# Altium schematic sheet conn_board_interfaces.SchDoc
size A
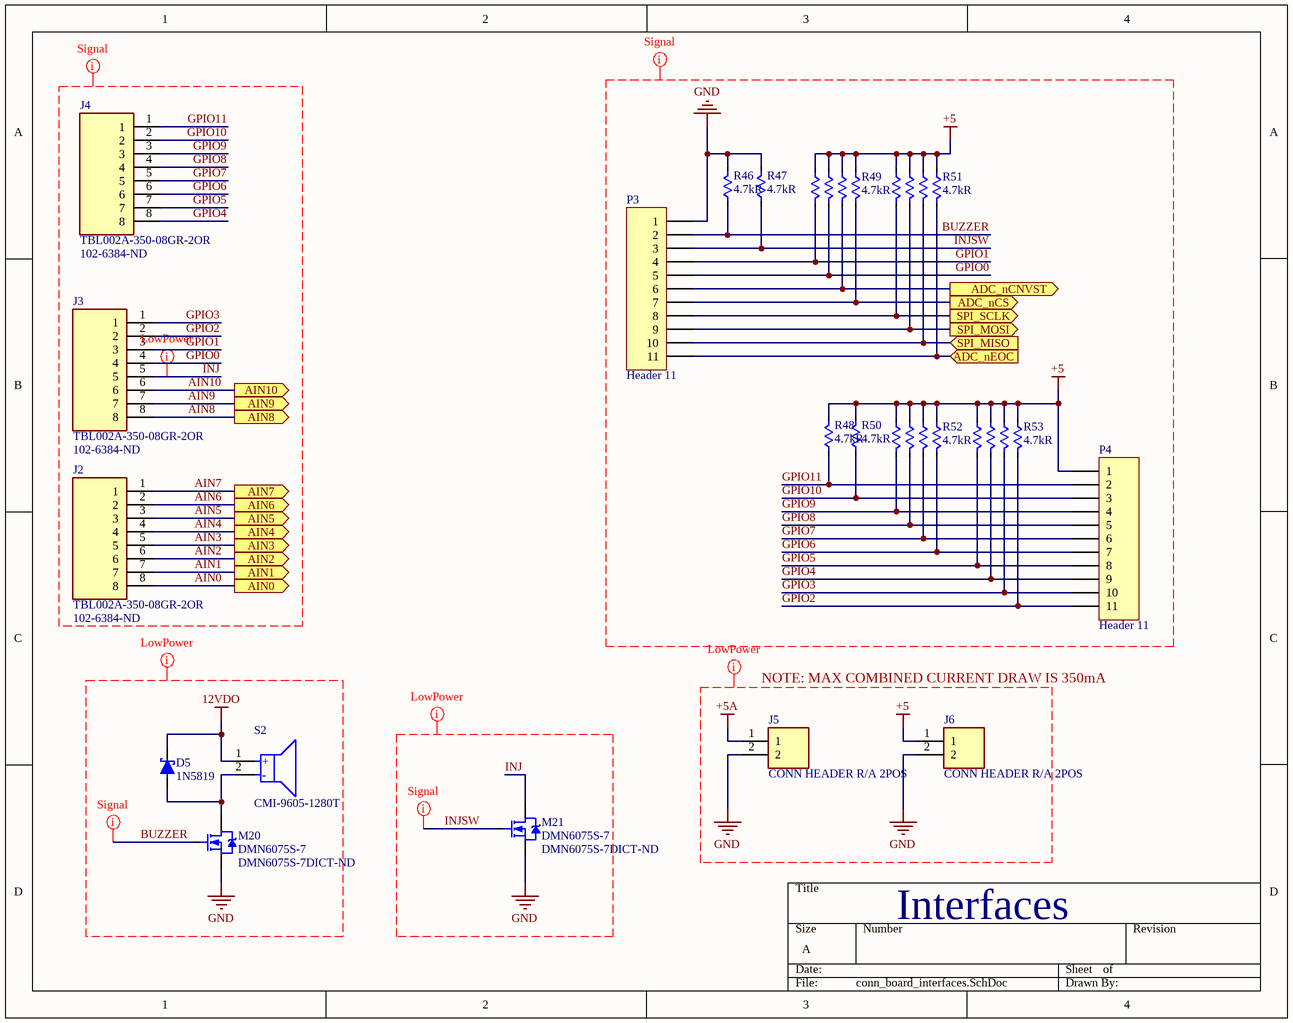
[diagram p0: conn_board_interfaces.SchDoc]

## Parts
D5  1N5819  [SOD123]
J2  TBL002A-350-08GR-2OR  Supplier Part Number 1: 102-6384-ND  [CUI_TBL002A-350-08GR-2OR]
J3  TBL002A-350-08GR-2OR  Supplier Part Number 1: 102-6384-ND  [CUI_TBL002A-350-08GR-2OR]
J4  TBL002A-350-08GR-2OR  Supplier Part Number 1: 102-6384-ND  [CUI_TBL002A-350-08GR-2OR]
J5  CONN HEADER R/A 2POS  [2 POS MOLEX]
J6  CONN HEADER R/A 2POS  [2 POS MOLEX]
M20  DMN6075S-7  Supplier Part Number 1: DMN6075S-7DICT-ND  [FP-SOT23-MFG]
M21  DMN6075S-7  Supplier Part Number 1: DMN6075S-7DICT-ND  [FP-SOT23-MFG]
P3  Header 11  [HDR1X11]
P4  Header 11  [HDR1X11]
R46  4.7kR  [RES_0805_PANASONIC]
R47  4.7kR  [RES_0805_PANASONIC]
R48  4.7kR  [RES_0805_PANASONIC]
R49  4.7kR  [CAY16-472J4LF]
R50  4.7kR  [RES_0805_PANASONIC]
R51  4.7kR  [CAY16-472J4LF]
R52  4.7kR  [CAY16-472J4LF]
R53  4.7kR  [CAY16-472J4LF]
S2  CMI-9605-1280T  [CMI-9605-1280T]

## Ports
ADC_nCNVST (out), ADC_nCS (out), ADC_nEOC (in), AIN0 (out), AIN1 (out), AIN2 (out), AIN3 (out), AIN4 (out), AIN5 (out), AIN6 (out), AIN7 (out), AIN8 (out), AIN9 (out), AIN10 (out), SPI_MISO (in), SPI_MOSI (out), SPI_SCLK (out)

## Nets
12VDO: D5.1 S2.1(+)
+5: J6.1 P4.1 R48.2 R49.2 R49.4 R49.6 R49.8 R50.2 R51.2 R51.4 R51.6 R51.8 R52.2 R52.4 R52.6 R52.8 R53.2 R53.4 R53.6 R53.8
+5A: J5.1
GND: J5.2 J6.2 M20.S M21.S P3.1 R46.2 R47.2
ADC_nCNVST: P3.6 R49.5 ; port ADC_nCNVST
ADC_nCS: P3.7 R49.7 ; port ADC_nCS
ADC_nEOC: P3.11 R51.7 ; port ADC_nEOC
AIN0: J2.8 ; port AIN0
AIN1: J2.7 ; port AIN1
AIN2: J2.6 ; port AIN2
AIN3: J2.5 ; port AIN3
AIN4: J2.4 ; port AIN4
AIN5: J2.3 ; port AIN5
AIN6: J2.2 ; port AIN6
AIN7: J2.1 ; port AIN7
AIN8: J3.8 ; port AIN8
AIN9: J3.7 ; port AIN9
AIN10: J3.6 ; port AIN10
BUZZER: M20.G P3.2 R46.1
GPIO0: J3.4 P3.5 R49.3
GPIO1: J3.3 P3.4 R49.1
GPIO2: J3.2 P4.11 R53.7
GPIO3: J3.1 P4.10 R53.5
GPIO4: J4.8 P4.9 R53.3
GPIO5: J4.7 P4.8 R53.1
GPIO6: J4.6 P4.7 R52.7
GPIO7: J4.5 P4.6 R52.5
GPIO8: J4.4 P4.5 R52.3
GPIO9: J4.3 P4.4 R52.1
GPIO10: J4.2 P4.3 R50.1
GPIO11: J4.1 P4.2 R48.1
INJ: J3.5 M21.D
INJSW: M21.G P3.3 R47.1
SPI_MISO: P3.10 R51.5 ; port SPI_MISO
SPI_MOSI: P3.9 R51.3 ; port SPI_MOSI
SPI_SCLK: P3.8 R51.1 ; port SPI_SCLK
NetD5_2: D5.2 M20.D S2.2(-)

## Layout directives
net class Signal: +5, AIN0, AIN1, AIN2, AIN3, AIN4, AIN5, AIN6, AIN7, AIN8, AIN9, AIN10, BUZZER, GND, GPIO0, GPIO1, GPIO2, GPIO3, GPIO4, GPIO5, GPIO6, GPIO7, GPIO8, GPIO9, GPIO10, GPIO11, INJ, INJSW
net class LowPower: 12VDO, +5, +5A, BUZZER, GND, INJ, INJSW
mark named Signal: BUZZER, INJSW

## Notes on the sheet
- NOTE: MAX COMBINED CURRENT DRAW IS 350mA
- Interfaces

## Library data of the parts
D5 = 1N5819HW-7-F: DIODES INC. - 1N5819HW-7-F - DIODE, SCKY RECTI, 1A, 40V, SOD123; Element Configuration: Single; Peak Non-Repetitive Surge Current: 25A; Forward Voltage: 450mV; Peak Reverse Current: 50uA; Polarity: Standard; Capacitance: 110pF; Max Power Dissipation: 450mW; Supplier 1: Digi-Key; Manufacturer: Diodes; Manufacturer Part Number: 1N5819HW-7-F; RoHS: Yes; Category: Diode; Stock 1: 502732; Pricing 1: 1=0.40000, 10=0.30100, 25=0.26360, 100=0.14310, 500=0.11678, 1000=0.08664 (USD); Case/Package: SOD-123-2; Number of Pins: 2; Weight: 0.000353oz; Contact Plating: Tin,Matte; Min Operating Temperature: -65°C; Max Operating Temperature: 125°C; Packaging: Tape and Reel; Package Quantity: 3000; Forward Current: 1A; Max Repetitive Reverse Voltage (Vrrm): 40V; Average Rectified Current: 1A; Max Reverse Voltage (DC): 40V; Max Forward Surge Current (Ifsm): 25A; Current Rating: 1A; Voltage Rating (DC): 40V; Output Current: 1A; Termination: SMD/SMT; Length: 2.85mm; Height: 1.25mm; Width: 1.7mm; Radiation Hardening: No; Lead Free: Lead Free; REACH SVHC: No SVHC; ComponentLink1URL: https://datasheet.ciiva.com/16303/ds30217-16303296.pdf?src-supplier=Future+Electronics; ComponentLink1Description: https://datasheet.ciiva.com/16303/ds30217-16303296.pdf?src-supplier=Future+Electronics; ComponentLink2URL: https://datasheet.ciiva.com/27092/1538419-27092484.pdf?src-supplier=Jameco; ComponentLink2Description: https://datasheet.ciiva.com/27092/1538419-27092484.pdf?src-supplier=Jameco; ComponentLink3URL: https://datasheet.ciiva.com/912/ds30217-912801.pdf?src-supplier=Digi-Key; ComponentLink3Description: https://datasheet.ciiva.com/912/ds30217-912801.pdf?src-supplier=Digi-Key; ComponentLink4URL: https://datasheet.ciiva.com/1177/ds30217-1177089.pdf?src-supplier=Element14; ComponentLink4Description: https://datasheet.ciiva.com/1177/ds30217-1177089.pdf?src-supplier=Element14; ComponentLink5URL: https://datasheet.ciiva.com/912/ds30217-912802.pdf?src-supplier=Digi-Key; ComponentLink5Description: https://datasheet.ciiva.com/912/ds30217-912802.pdf?src-supplier=Digi-Key; ComponentLink6URL: https://datasheet.ciiva.com/912/ds30217-912803.pdf?src-supplier=Digi-Key; ComponentLink6Description: https://datasheet.ciiva.com/912/ds30217-912803.pdf?src-supplier=Digi-Key; ComponentLink7URL: https://datasheet.ciiva.com/8303/ds30217-8303132.pdf?src-supplier=Avnet; ComponentLink7Description: https://datasheet.ciiva.com/8303/ds30217-8303132.pdf?src-supplier=Avnet; ComponentLink8URL: https://datasheet.ciiva.com/25919/ds30217-25919644.pdf?src-supplier=Avnet+Europe; ComponentLink8Description: https://datasheet.ciiva.com/25919/ds30217-25919644.pdf?src-supplier=Avnet+Europe; Supplier Part Number 1: 1N5819HW-FDICT-ND
J2-J4 = TBL002A-350-08GR-2OR: 1~24 Poles, Screwless, 45Â°, 3.50 Pitch, 24~20 (AWG), Terminal Block Connector; MF: CUI Devices; SnapEDA_Link: https://www.snapeda.com/parts/TBL002A-350-08GR-2OR/CUI%20Devices/view-part/3233590/?ref=snap; Availability: Unavailable; Price: None; MP: TBL002A-350-08GR-2OR; Package: None; Value: *; Category: Connector; Supplier 1: Digi-Key
J5 J6 = 1724480002: Manufacturer: Molex; Connector Type: Male Pin; Number of Circuits: 2; Row Spacing: 0.165inch; Glow Wire Compliant: Compliant; Supplier 1: Digi-Key; Manufacturer Part Number: 1724480002; RoHS: No; Category: Headers and Wire Housings; Stock 1: 6210; Pricing 1: 1=0.55000, 10=0.46000, 100=0.35780, 1000=0.28116, 5000=0.24708, 10000=0.23004 (USD); Mount: Through Hole; Number of Pins: 2; Contact Plating: Tin; Color: Black; Orientation: Right Angle; Packaging: Tray; Number of Positions: 2; Number of Rows: 2; Termination: Solder; Fastening Type: Ramp; ComponentLink1URL: https://www.molex.com/pdm_docs/sd/1724480002_sd.pdf?src-supplier=Digi-Key; ComponentLink1Description: https://www.molex.com/pdm_docs/sd/1724480002_sd.pdf?src-supplier=Digi-Key; Supplier Part Number 1: WM16206-ND
M20 M21 = CMP-12801-000014-1: MOSFET 60V N-Ch Enh FET 20Vgss 0.8W 600pF; Manufacturer: Diodes Inc.; Max Junction Temp: +150°C; Continuous Drain Current: 2A; Rthja Max: 157°C/W; Turn On Delay Time: 3.5ns; Gate To Source Voltage: 20V; Input Capacitace At Vds: 606pF @ 20V; Depletion Mode: False; Number Of Channels: 1; Pulse Drain Current: 12A; Standoff Height: 0.013mm; Turn Off Delay Time: 35ns; Threshold Vgs Max: 3V; Automotive Grade: Grade 0; Max Forward Diode Voltage: 1.2V; Gate Charge At Vgs: 12.3nC @ 10V; Threshold Vgs Min: 1V; Drain To Source Resistance: 69mΩ; Rds On Max: 85mR; Input Capacitance: 606pF; Max Power Dissipation: 800mW; Device Class L2: Transistors; Height: 1.1mm; ComponentLink2Description: Datasheet; Footprint Url: https://www.diodes.com/assets/Package-Files/SOT23.pdf; Device Class L1: Discrete Semiconductors; Digikey Description: MOSFET N-CH 60V 2A SOT23-3; Device Class L3: MOSFETs; Mouser Description: MOSFET 60V N-Ch Enh FET 20Vgss 0.8W 600pF; Manufacturer Part Number: DMN6075S-7; Package: SOT23; Power Dissipation: 0.8W; Temperature Range High: +150°C; Drain To Source Breakdown Voltage: 60V; Automotive: Yes; Lead Free: Yes; ComponentLink2URL: https://www.diodes.com/assets/Datasheets/DMN6075S.pdf; Category: Trans; Temperature Range Low: -55°C; Number Of N Channels: 1; Octopart: https://octopart.com/dmn6075s-7-diodes+inc.-55697882; RoHS: TRUE; Temperature: -55°C to +150°C; Drain To Source Voltage: 60V; Supplier 1: Digi-Key; Stock 1: 363651; Pricing 1: 1=0.33000, 10=0.23000, 25=0.21440, 100=0.11630, 500=0.09486, 1000=0.07038 (USD); Mount: Surface Mount; Case/Package: TO-236-3; Min Operating Temperature: -55°C; Max Operating Temperature: 150°C; Packaging: Tape and Reel; Drain to Source Voltage (Vdss): 60V; Continuous Drain Current (ID): 2A; ComponentLink1URL: http://www.mouser.com/ds/2/115/DMN6075S-532804.pdf?src-supplier=Mouser; ComponentLink1Description: http://www.mouser.com/ds/2/115/DMN6075S-532804.pdf?src-supplier=Mouser; ComponentLink3URL: https://www.diodes.com/assets/Datasheets/DMN6075S.pdf?src-supplier=Digi-Key; ComponentLink3Description: https://www.diodes.com/assets/Datasheets/DMN6075S.pdf?src-supplier=Digi-Key
P3 P4 = Header 11: Header, 11-Pin; LatestRevisionDate: 17-Jul-2002; LatestRevisionNote: Re-released for DXP Platform.; Publisher: Altium Limited
R46-R48 R50 = ERA-6AED472V: Res Thin Film 0805 4.7K Ohm 0.5% 0.125W(1/8W) ±25ppm/C Molded SMD Automotive Punched T/R; Manufacturer: Panasonic; Temperature Coefficient: 25ppm/°C; Power Rating: 125mW; Voltage Rating: 100V; Supplier 1: Digi-Key; Manufacturer Part Number: ERA-6AED472V; RoHS: Yes; Category: Chip SMD Resistors; Stock 1: 25343; Pricing 1: 1=0.10000, 10=0.09400, 100=0.03600, 1000=0.01584, 2500=0.01368 (USD); Case/Package: 0805; Case Code (Metric): 2012; Case Code (Imperial): 0805; Min Operating Temperature: -55°C; Max Operating Temperature: 155°C; Package Quantity: 5000; Packaging: Tape and Reel; Resistance: 4.7kR; Tolerance: 0.5%; Length: 2mm; Height: 0.5mm; Width: 1.25mm; Lead Free: Lead Free; ComponentLink1URL: https://datasheet.ciiva.com/24027/aoa0000ce26-32660-24027576.pdf?src-supplier=Mouser; ComponentLink1Description: https://datasheet.ciiva.com/24027/aoa0000ce26-32660-24027576.pdf?src-supplier=Mouser; Supplier Part Number 1: P123914CT-ND; Mount: Surface Mount; Contact Plating: Tin; Resistor Type: Metal Film,Thin Film; Depth: 1.25mm; Military Standard: Not
R49 R51-R53 = CAY16-472J4LF: RES ARRAY 4 RES 4.7K OHM 1206; Manufacturer: Bourns; Number of Resistors: 4; Voltage Rating (DC): 50V; Circuit Type: Isolated; Power Per Element: 62.5mW; Temperature Coefficient: 200ppm/°C; Tolerance: 5%; Power Rating: 248mW; Supplier 1: Digi-Key; Manufacturer Part Number: CAY16-472J4LF; RoHS: Yes; Category: Resistor; Stock 1: 28152; Pricing 1: 1=0.10000, 10=0.06900, 25=0.04760, 50=0.03720, 100=0.02650, 250=0.02068, 500=0.01644, 1000=0.01166 (USD); Mount: Surface Mount; Case/Package: 1206; Number of Pins: 8; Number of Terminals: 8; Contact Plating: Tin; Case Code (Imperial): 1206; Case Code (Metric): 3216; Min Operating Temperature: -55°C; Max Operating Temperature: 125°C; Resistance: 4.7kR; Number of Circuits: 4; Termination: Convex; Military Standard: Not; Composition: Thick Film; Voltage Rating: 50V; Number of Elements: 4; Packaging: Tape and Reel; Package Quantity: 1; Length: 3.2mm; Height: 0.024inch; Terminal Pitch: 0.8mm; Depth: 1.6mm; Width: 0.063inch; Radiation Hardening: No; REACH SVHC: No SVHC; ComponentLink1URL: https://datasheet.ciiva.com/19466/1979708-19466930.pdf?src-supplier=Jameco; ComponentLink1Description: https://datasheet.ciiva.com/19466/1979708-19466930.pdf?src-supplier=Jameco; ComponentLink2URL: https://datasheet.ciiva.com/11807/0900766b8064e462-11807155.pdf?src-supplier=RSComponents; ComponentLink2Description: https://datasheet.ciiva.com/11807/0900766b8064e462-11807155.pdf?src-supplier=RSComponents; ComponentLink3URL: https://datasheet.ciiva.com/1478/1849489-1478912.pdf?src-supplier=Element14; ComponentLink3Description: https://datasheet.ciiva.com/1478/1849489-1478912.pdf?src-supplier=Element14; ComponentLink4URL: https://datasheet.ciiva.com/25907/catcay-25907158.pdf?src-supplier=Avnet+Europe; ComponentLink4Description: https://datasheet.ciiva.com/25907/catcay-25907158.pdf?src-supplier=Avnet+Europe; ComponentLink5URL: https://datasheet.ciiva.com/30249/catcay-30249688.pdf?src-supplier=Onlinecomponents.com; ComponentLink5Description: https://datasheet.ciiva.com/30249/catcay-30249688.pdf?src-supplier=Onlinecomponents.com; ComponentLink6URL: https://datasheet.ciiva.com/6494/catcay-6494015.pdf?src-supplier=Digi-Key; ComponentLink6Description: https://datasheet.ciiva.com/6494/catcay-6494015.pdf?src-supplier=Digi-Key; ComponentLink7URL: https://datasheet.ciiva.com/3264/catcay-3264889.pdf?src-supplier=Avnet; ComponentLink7Description: https://datasheet.ciiva.com/3264/catcay-3264889.pdf?src-supplier=Avnet; ComponentLink8URL: https://datasheet.ciiva.com/3263/catcay-3263770.pdf?src-supplier=Avnet; ComponentLink8Description: https://datasheet.ciiva.com/3263/catcay-3263770.pdf?src-supplier=Avnet; ComponentLink9URL: https://datasheet.ciiva.com/1478/1849489-1478911.pdf?src-supplier=Element14; ComponentLink9Description: https://datasheet.ciiva.com/1478/1849489-1478911.pdf?src-supplier=Element14; Supplier Part Number 1: CAY16-472J4LFCT-ND
S2 = CMI-9605-1280T: Buzzers Indicator, Internally Driven Magnetic 12V 30mA 2.7kHz 80dB @ 12V, 10cm Through Hole PC Pins; Manufacturer: CUI; Supplier 1: Digi-Key; Manufacturer Part Number: CMI-9605-1280T; RoHS: No; Category: Audio Products; Stock 1: 2147; Pricing 1: 1=1.22000, 10=1.01900, 25=0.94360, 50=0.88800, 100=0.83460, 500=0.71806, 1000=0.67126, 5000=0.65780 (USD); Supplier Part Number 1: 102-CMI-9605-1280T-ND